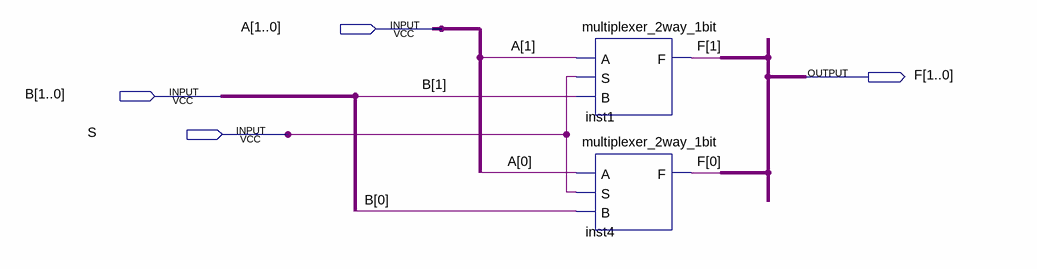
[diagram p0: schematic sheet]
// Quartus schematic multiplexer_2way_2bit.bdf as structural Verilog: 2 symbols, 4 pins
module multiplexer_2way_2bit (
  input  [1:0] A,
  input  [1:0] B,
  input  S,
  output [1:0] F
);

  multiplexer_2way_1bit inst1 (.A(A[1]), .S(S), .B(B[1]), .F(F[1]));
  multiplexer_2way_1bit inst4 (.A(A[0]), .S(S), .B(B[0]), .F(F[0]));
endmodule
